# Altium schematic sheet 51ExpBoardTotal.SchDoc
size A4
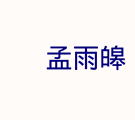
[diagram p0: 51ExpBoardTotal.SchDoc]

## Notes on the sheet
- 孟雨皞